# EasyEDA schematic audio chip v2.json
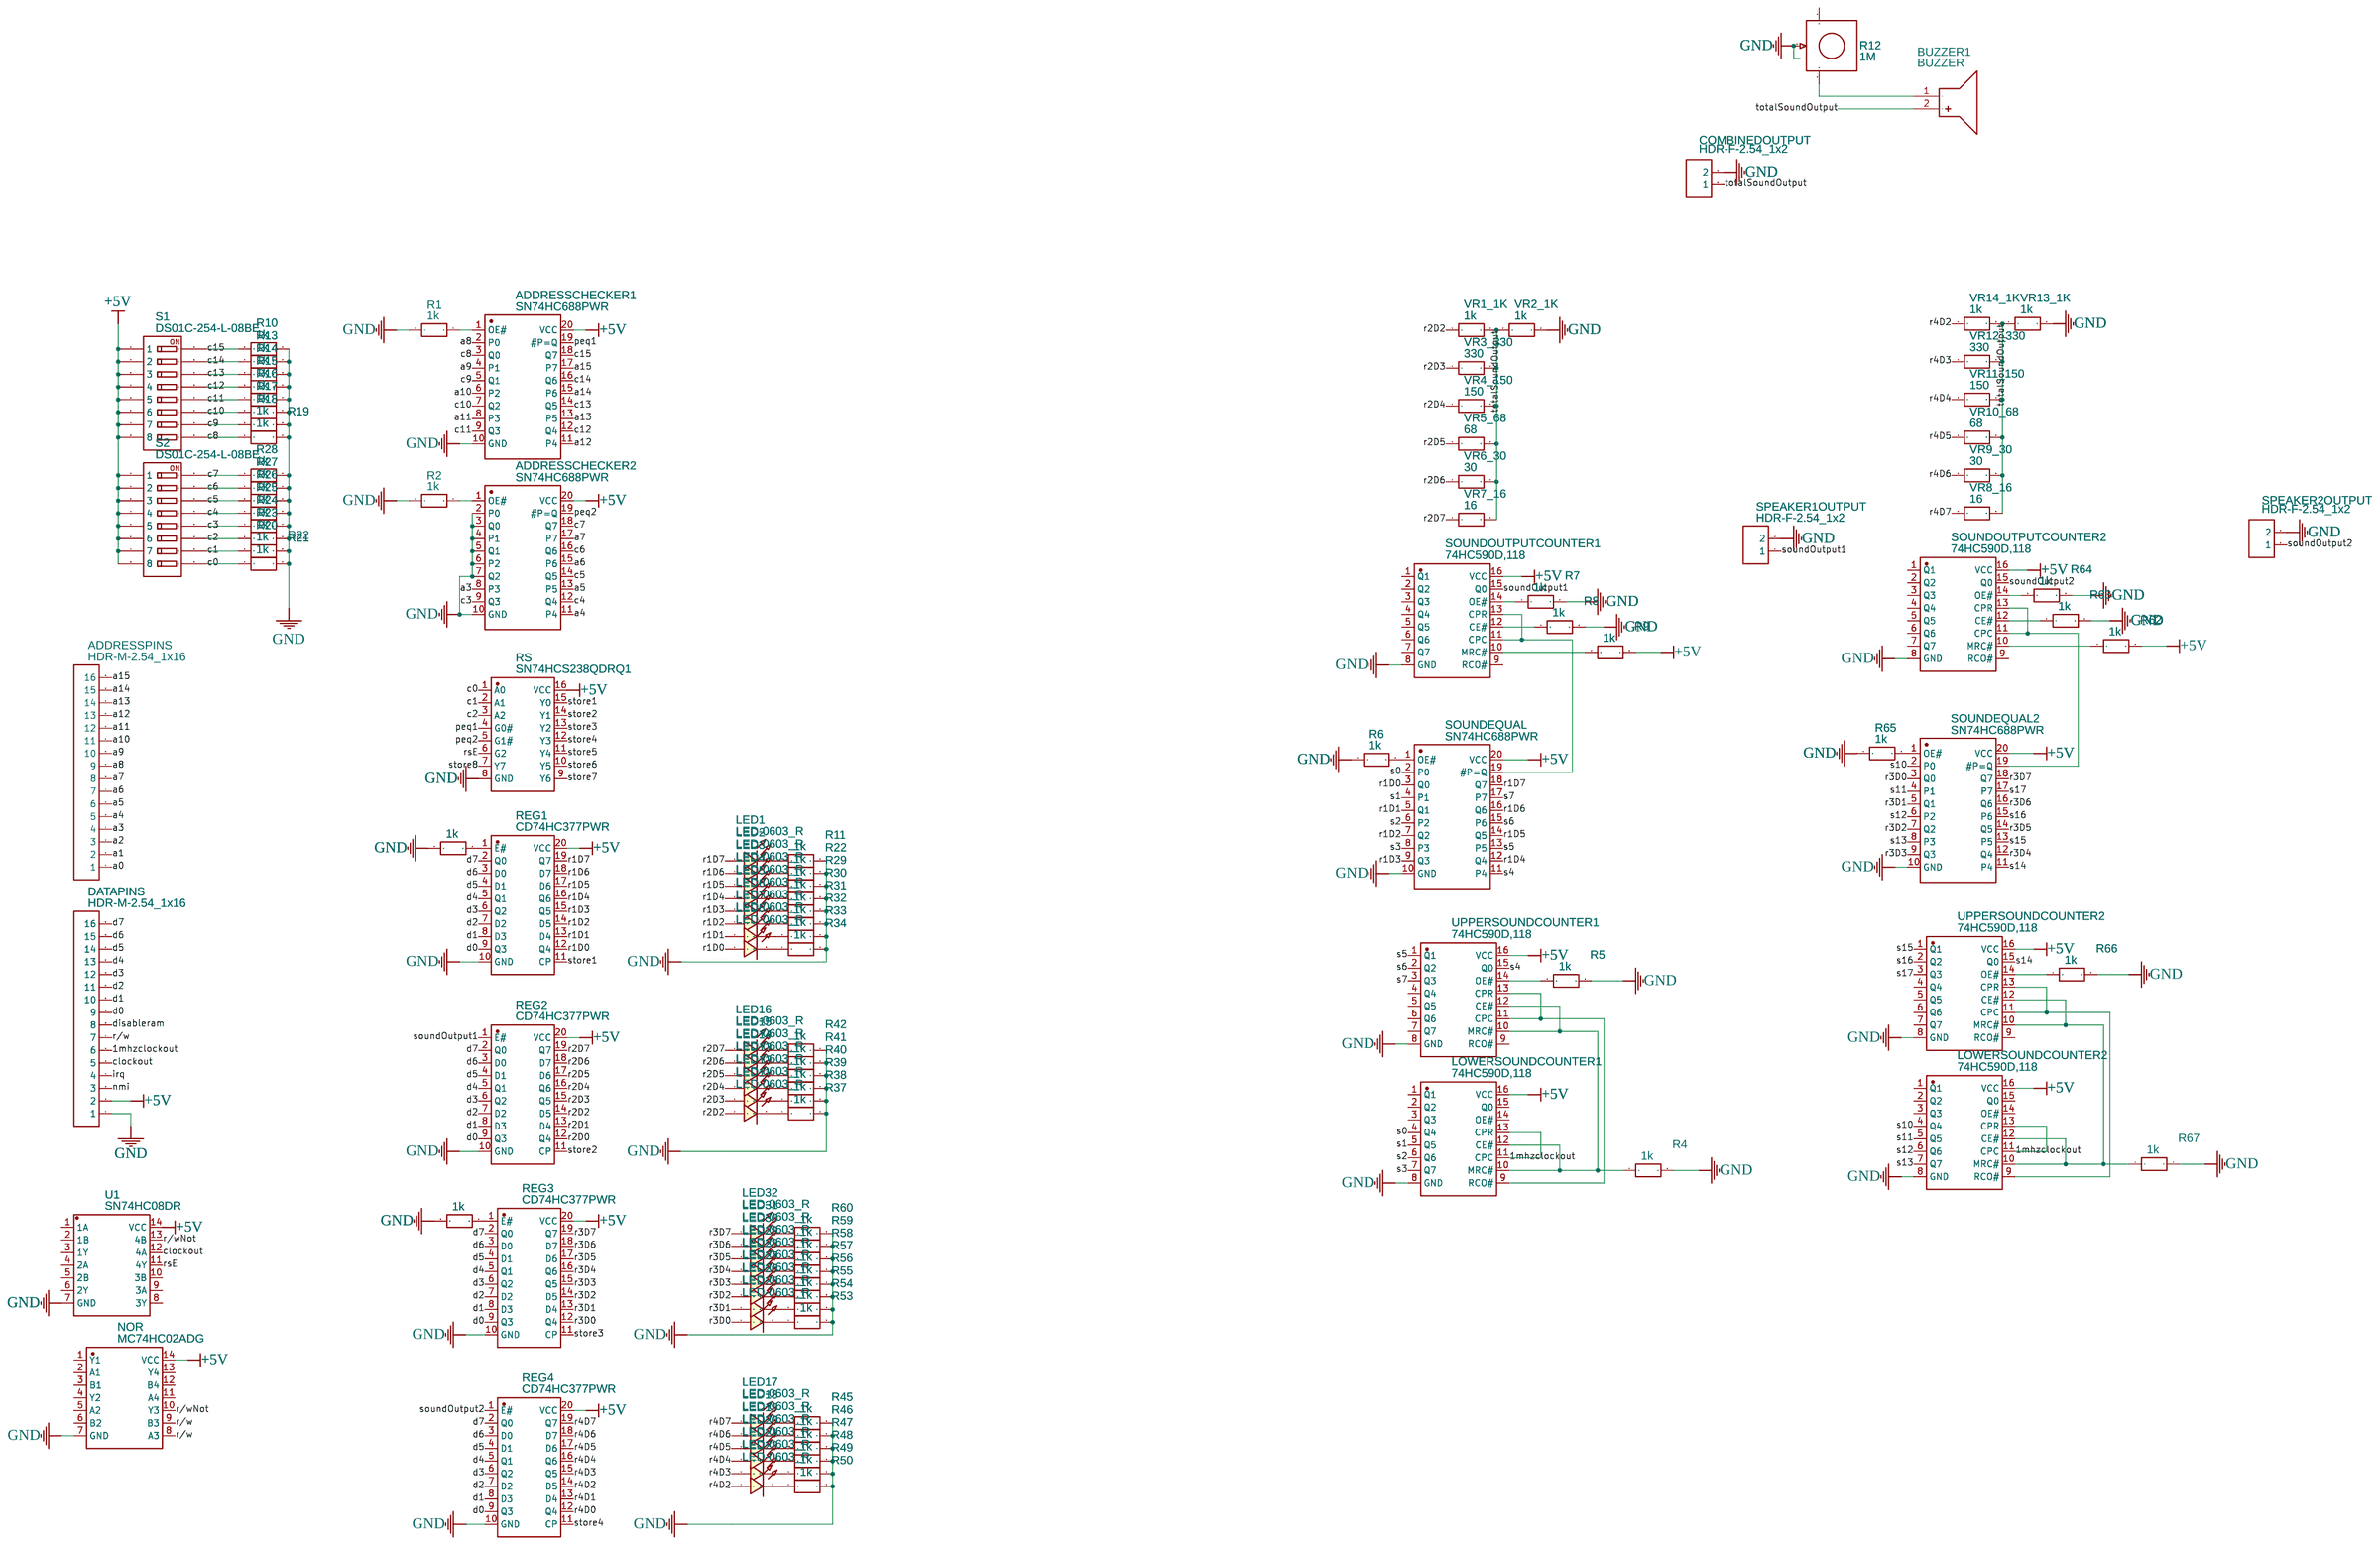
[diagram p0: schematic sheet]

## Parts
ADDRESSCHECKER1  SN74HC688PWR  [TSSOP-20_L6.5-W4.4-P0.65-LS6.4-BL]
ADDRESSCHECKER2  SN74HC688PWR  [TSSOP-20_L6.5-W4.4-P0.65-LS6.4-BL]
ADDRESSPINS  HDR-M-2.54_1x16  [HDR-M-2.54_1X16]
BUZZER1  BUZZER  [BUZ-TH_BD12.0-P6.00-D0.9-RD]
COMBINEDOUTPUT  HDR-F-2.54_1x2  [HDR-F-2.54_1X2]
DATAPINS  HDR-M-2.54_1x16  [HDR-M-2.54_1X16]
LED1  LED-0603_R  [LED0603_RED]
LED2  LED-0603_R  [LED0603_RED]
LED3  LED-0603_R  [LED0603_RED]
LED4  LED-0603_R  [LED0603_RED]
LED5  LED-0603_R  [LED0603_RED]
LED6  LED-0603_R  [LED0603_RED]
LED7  LED-0603_R  [LED0603_RED]
LED8  LED-0603_R  [LED0603_RED]
LED11  LED-0603_R  [LED0603_RED]
LED12  LED-0603_R  [LED0603_RED]
LED13  LED-0603_R  [LED0603_RED]
LED14  LED-0603_R  [LED0603_RED]
LED15  LED-0603_R  [LED0603_RED]
LED16  LED-0603_R  [LED0603_RED]
LED17  LED-0603_R  [LED0603_RED]
LED18  LED-0603_R  [LED0603_RED]
LED19  LED-0603_R  [LED0603_RED]
LED20  LED-0603_R  [LED0603_RED]
LED21  LED-0603_R  [LED0603_RED]
LED22  LED-0603_R  [LED0603_RED]
LED25  LED-0603_R  [LED0603_RED]
LED26  LED-0603_R  [LED0603_RED]
LED27  LED-0603_R  [LED0603_RED]
LED28  LED-0603_R  [LED0603_RED]
LED29  LED-0603_R  [LED0603_RED]
LED30  LED-0603_R  [LED0603_RED]
LED31  LED-0603_R  [LED0603_RED]
LED32  LED-0603_R  [LED0603_RED]
LOWERSOUNDCOUNTER1  74HC590D,118  [SO-16_L9.9-W3.9-P1.27-LS6.0-BL]
LOWERSOUNDCOUNTER2  74HC590D,118  [SO-16_L9.9-W3.9-P1.27-LS6.0-BL]
NOR  MC74HC02ADG  [SOIC-14_L8.7-W3.9-P1.27-LS6.0-BL]
R1  1k  [R1206]
R2  1k  [R1206]
R3  1k  [R1206]
R4  1k  [R1206]
R5  1k  [R1206]
R6  1k  [R1206]
R7  1k  [R1206]
R8  1k  [R1206]
R9  1k  [R1206]
R10  1k  [R1206]
R11  1k  [R1206]
R12  1M  [3386T]
R13  1k  [R1206]
R14  1k  [R1206]
R15  1k  [R1206]
R16  1k  [R1206]
R17  1k  [R1206]
R18  1k  [R1206]
R19  1k  [R1206]
R20  1k  [R1206]
R21  1k  [R1206]
R22  1k  [R1206]
R23  1k  [R1206]
R24  1k  [R1206]
R25  1k  [R1206]
R26  1k  [R1206]
R27  1k  [R1206]
R28  1k  [R1206]
R29  1k  [R1206]
R30  1k  [R1206]
R31  1k  [R1206]
R32  1k  [R1206]
R33  1k  [R1206]
R34  1k  [R1206]
R37  1k  [R1206]
R38  1k  [R1206]
R39  1k  [R1206]
R40  1k  [R1206]
R41  1k  [R1206]
R42  1k  [R1206]
R45  1k  [R1206]
R46  1k  [R1206]
R47  1k  [R1206]
R48  1k  [R1206]
R49  1k  [R1206]
R50  1k  [R1206]
R53  1k  [R1206]
R54  1k  [R1206]
R55  1k  [R1206]
R56  1k  [R1206]
R57  1k  [R1206]
R58  1k  [R1206]
R59  1k  [R1206]
R60  1k  [R1206]
R61  1k  [R1206]
R62  1k  [R1206]
R63  1k  [R1206]
R64  1k  [R1206]
R65  1k  [R1206]
R66  1k  [R1206]
R67  1k  [R1206]
REG1  CD74HC377PWR  [TSSOP-20_L6.5-W4.4-P0.65-LS6.4-BL]
REG2  CD74HC377PWR  [TSSOP-20_L6.5-W4.4-P0.65-LS6.4-BL]
REG3  CD74HC377PWR  [TSSOP-20_L6.5-W4.4-P0.65-LS6.4-BL]
REG4  CD74HC377PWR  [TSSOP-20_L6.5-W4.4-P0.65-LS6.4-BL]
RS  SN74HCS238QDRQ1  [SOIC-16_L9.9-W3.9-P1.27-LS6.0-BL]
S1  DS01C-254-L-08BE  [DS01C-254-L-08BE]
S2  DS01C-254-L-08BE  [DS01C-254-L-08BE]
SOUNDEQUAL  SN74HC688PWR  [TSSOP-20_L6.5-W4.4-P0.65-LS6.4-BL]
SOUNDEQUAL2  SN74HC688PWR  [TSSOP-20_L6.5-W4.4-P0.65-LS6.4-BL]
SOUNDOUTPUTCOUNTER1  74HC590D,118  [SO-16_L9.9-W3.9-P1.27-LS6.0-BL]
SOUNDOUTPUTCOUNTER2  74HC590D,118  [SO-16_L9.9-W3.9-P1.27-LS6.0-BL]
SPEAKER1OUTPUT  HDR-F-2.54_1x2  [HDR-F-2.54_1X2]
SPEAKER2OUTPUT  HDR-F-2.54_1x2  [HDR-F-2.54_1X2]
U1  SN74HC08DR  [SOIC-14_L8.7-W3.9-P1.27-LS6.0-BL]
UPPERSOUNDCOUNTER1  74HC590D,118  [SO-16_L9.9-W3.9-P1.27-LS6.0-BL]
UPPERSOUNDCOUNTER2  74HC590D,118  [SO-16_L9.9-W3.9-P1.27-LS6.0-BL]
VR1_1K  1k  [R1206]
VR2_1K  1k  [R1206]
VR3_330  330  [R1206]
VR4_150  150  [R1206]
VR5_68  68  [R1206]
VR6_30  30  [R1206]
VR7_16  16  [R1206]
VR8_16  16  [R1206]
VR9_30  30  [R1206]
VR10_68  68  [R1206]
VR11_150  150  [R1206]
VR12_330  330  [R1206]
VR13_1K  1k  [R1206]
VR14_1K  1k  [R1206]

## Library data of the parts
ADDRESSCHECKER1 ADDRESSCHECKER2 SOUNDEQUAL SOUNDEQUAL2 = SN74HC688PWR: Contributor: LCSC; Supplier: LCSC; Manufacturer: TI(德州仪器); Supplier Part: C132045; JLCPCB Part Class: Extended Part; link: https://lcsc.com/eda_search?q=C132045&%26type=1&ref=editor
ADDRESSPINS DATAPINS = HDR-M-2.54_1x16: Supplier: LCSC; Contributor: LCEDA_Lib
BUZZER1 = BUZZER: Contributor: lcsc; Supplier: LCSC; Supplier Part: C9900014030; Manufacturer: null; Manufacturer Part: buzzer; JLCPCB Part Class: Extended Part; link: https://lcsc.com/eda_search?q=C9900014030&%26type=1&ref=editor
COMBINEDOUTPUT SPEAKER1OUTPUT SPEAKER2OUTPUT = HDR-F-2.54_1x2: Supplier Part: C49661; Supplier: LCSC; Contributor: LCEDA_Lib
LED1-LED8 LED11-LED22 LED25-LED32 = LED-0603_R: Manufacturer: EVERLIGHT(台湾亿光); Manufacturer Part: 19-217/R6C-AL1M2VY/3T; Supplier Part: C72044; Supplier: LCSC; Contributor: LCEDA_01
LOWERSOUNDCOUNTER1 LOWERSOUNDCOUNTER2 SOUNDOUTPUTCOUNTER1 SOUNDOUTPUTCOUNTER2 UPPERSOUNDCOUNTER1 UPPERSOUNDCOUNTER2 = 74HC590D,118: Contributor: LCSC; Supplier: LCSC; Supplier Part: C547118; Manufacturer: Nexperia(安世); JLCPCB Part Class: Extended Part; link: https://lcsc.com/eda_search?q=C547118&%26type=1&ref=editor
NOR = MC74HC02ADG: Contributor: LCSC; Supplier: LCSC; Supplier Part: C233598; Manufacturer: onsemi(安森美); JLCPCB Part Class: Extended Part; link: https://lcsc.com/eda_search?q=C233598&%26type=1&ref=editor
R1-R11 R13-R34 R37-R42 R45-R50 R53-R67 VR1_1K VR2_1K VR3_330 VR4_150 VR5_68 VR6_30 VR7_16 VR8_16 VR9_30 VR10_68 VR11_150 VR12_330 VR13_1K VR14_1K = R_1206_EU: Contributor: LCEDA_Lib
R12 = 3/8 Inch Square Cermet Potentiometer 1MEG Ohms 1/2 Watt 1 Turn Thru Hole: Manufacturer: Jameco ValuePro; Manufacturer Part: 3386T-1-LS1MEG(105); Supplier Part: 2161422; link: https://www.jameco.com/webapp/wcs/stores/servlet/ProductDisplay?storeId=10001&langId=-1&catalogId=10001&productId=2161422; Contributor: dissy614
REG1-REG4 = CD74HC377PWR: Contributor: LCSC; Supplier: LCSC; Supplier Part: C2677832; Manufacturer: TI(德州仪器); JLCPCB Part Class: Extended Part; link: https://lcsc.com/eda_search?q=C2677832&%26type=1&ref=editor
RS = SN74HCS238QDRQ1: Contributor: lcsc; Supplier: LCSC; Supplier Part: C2878562; Manufacturer: TI(德州仪器); link: https://lcsc.com/eda_search?q=C2878562&%26type=1&ref=editor
S1 S2 = DS01C-254-L-08BE: Manufacturer: CUI Devices; Manufacturer Part: DS01C-254-L-07BE; Supplier: Mouser; Supplier Part: 490-DS01C-254-L-07BE; link: https://www.mouser.com/datasheet/2/670/ds01-254-1777712.pdf; Contributor: CK Sim
U1 = SN74HC08DR: Contributor: LCSC; Supplier: LCSC; Supplier Part: C337768; Manufacturer: TI(德州仪器); JLCPCB Part Class: Extended Part; link: https://lcsc.com/eda_search?q=C337768&%26type=1&ref=editor

## Nets
+5V: ADDRESSCHECKER1.20(VCC) ADDRESSCHECKER2.20(VCC) DATAPINS.2 LOWERSOUNDCOUNTER1.16(VCC) LOWERSOUNDCOUNTER2.16(VCC) NOR.14(VCC) R9.2 R62.2 REG1.20(VCC) REG2.20(VCC) REG3.20(VCC) REG4.20(VCC) RS.16(VCC) S1.1 S1.2 S1.3 S1.4 S1.5 S1.6 S1.7 S1.8 S2.1 S2.2 S2.3 S2.4 S2.5 S2.6 S2.7 S2.8 SOUNDEQUAL.20(VCC) SOUNDEQUAL2.20(VCC) SOUNDOUTPUTCOUNTER1.16(VCC) SOUNDOUTPUTCOUNTER2.16(VCC) U1.14(VCC) UPPERSOUNDCOUNTER1.16(VCC) UPPERSOUNDCOUNTER2.16(VCC)
GND: ADDRESSCHECKER1.10(GND) ADDRESSCHECKER2.2(P0) ADDRESSCHECKER2.3(Q0) ADDRESSCHECKER2.4(P1) ADDRESSCHECKER2.5(Q1) ADDRESSCHECKER2.6(P2) ADDRESSCHECKER2.7(Q2) ADDRESSCHECKER2.10(GND) COMBINEDOUTPUT.2 DATAPINS.1 LOWERSOUNDCOUNTER1.8(GND) LOWERSOUNDCOUNTER2.8(GND) NOR.7(GND) R1.1 R2.1 R3.1 R4.2 R5.2 R6.1 R7.2 R8.2 R10.2 R11.2 R12.2 R13.2 R14.2 R15.2 R16.2 R17.2 R18.2 R19.2 R20.2 R21.2 R22.2 R23.2 R24.2 R25.2 R26.2 R27.2 R28.2 R29.2 R30.2 R31.2 R32.2 R33.2 R34.2 R37.2 R38.2 R39.2 R40.2 R41.2 R42.2 R45.2 R46.2 R47.2 R48.2 R49.2 R50.2 R53.2 R54.2 R55.2 R56.2 R57.2 R58.2 R59.2 R60.2 R61.1 R63.2 R64.2 R65.1 R66.2 R67.2 REG1.10(GND) REG2.10(GND) REG3.10(GND) REG4.10(GND) RS.8(GND) SOUNDEQUAL.10(GND) SOUNDEQUAL2.10(GND) SOUNDOUTPUTCOUNTER1.8(GND) SOUNDOUTPUTCOUNTER2.8(GND) SPEAKER1OUTPUT.2 SPEAKER2OUTPUT.2 U1.7(GND) UPPERSOUNDCOUNTER1.8(GND) UPPERSOUNDCOUNTER2.8(GND) VR2_1K.2 VR13_1K.2
1mhzclockout: DATAPINS.6 LOWERSOUNDCOUNTER1.11(CPC) LOWERSOUNDCOUNTER1.13(CPR) LOWERSOUNDCOUNTER2.11(CPC) LOWERSOUNDCOUNTER2.13(CPR)
a0: ADDRESSPINS.1
a1: ADDRESSPINS.2
a2: ADDRESSPINS.3
a3: ADDRESSCHECKER2.8(P3) ADDRESSPINS.4
a4: ADDRESSCHECKER2.11(P4) ADDRESSPINS.5
a5: ADDRESSCHECKER2.13(P5) ADDRESSPINS.6
a6: ADDRESSCHECKER2.15(P6) ADDRESSPINS.7
a7: ADDRESSCHECKER2.17(P7) ADDRESSPINS.8
a8: ADDRESSCHECKER1.2(P0) ADDRESSPINS.9
a9: ADDRESSCHECKER1.4(P1) ADDRESSPINS.10
a10: ADDRESSCHECKER1.6(P2) ADDRESSPINS.11
a11: ADDRESSCHECKER1.8(P3) ADDRESSPINS.12
a12: ADDRESSCHECKER1.11(P4) ADDRESSPINS.13
a13: ADDRESSCHECKER1.13(P5) ADDRESSPINS.14
a14: ADDRESSCHECKER1.15(P6) ADDRESSPINS.15
a15: ADDRESSCHECKER1.17(P7) ADDRESSPINS.16
c0: R21.1 RS.1(A0) S2.9
c1: R20.1 RS.2(A1) S2.10
c2: R23.1 RS.3(A2) S2.11
c3: ADDRESSCHECKER2.9(Q3) R24.1 S2.12
c4: ADDRESSCHECKER2.12(Q4) R25.1 S2.13
c5: ADDRESSCHECKER2.14(Q5) R26.1 S2.14
c6: ADDRESSCHECKER2.16(Q6) R27.1 S2.15
c7: ADDRESSCHECKER2.18(Q7) R28.1 S2.16
c8: ADDRESSCHECKER1.3(Q0) R19.1 S1.9
c9: ADDRESSCHECKER1.5(Q1) R18.1 S1.10
c10: ADDRESSCHECKER1.7(Q2) R17.1 S1.11
c11: ADDRESSCHECKER1.9(Q3) R16.1 S1.12
c12: ADDRESSCHECKER1.12(Q4) R15.1 S1.13
c13: ADDRESSCHECKER1.14(Q5) R14.1 S1.14
c14: ADDRESSCHECKER1.16(Q6) R13.1 S1.15
c15: ADDRESSCHECKER1.18(Q7) R10.1 S1.16
clockout: DATAPINS.5 U1.12(4A)
d0: DATAPINS.9 REG1.9(Q3) REG2.9(Q3) REG3.9(Q3) REG4.9(Q3)
d1: DATAPINS.10 REG1.8(D3) REG2.8(D3) REG3.8(D3) REG4.8(D3)
d2: DATAPINS.11 REG1.7(D2) REG2.7(D2) REG3.7(D2) REG4.7(D2)
d3: DATAPINS.12 REG1.6(Q2) REG2.6(Q2) REG3.6(Q2) REG4.6(Q2)
d4: DATAPINS.13 REG1.5(Q1) REG2.5(Q1) REG3.5(Q1) REG4.5(Q1)
d5: DATAPINS.14 REG1.4(D1) REG2.4(D1) REG3.4(D1) REG4.4(D1)
d6: DATAPINS.15 REG1.3(D0) REG2.3(D0) REG3.3(D0) REG4.3(D0)
d7: DATAPINS.16 REG1.2(Q0) REG2.2(Q0) REG3.2(Q0) REG4.2(Q0)
disableram: DATAPINS.8
irq: DATAPINS.4
nmi: DATAPINS.3
peq1: ADDRESSCHECKER1.19(#P=Q) RS.4(G0#)
peq2: ADDRESSCHECKER2.19(#P=Q) RS.5(G1#)
r1D0: LED8.1 REG1.12(Q4) SOUNDEQUAL.3(Q0)
r1D1: LED7.1 REG1.13(D4) SOUNDEQUAL.5(Q1)
r1D2: LED6.1 REG1.14(D5) SOUNDEQUAL.7(Q2)
r1D3: LED5.1 REG1.15(Q5) SOUNDEQUAL.9(Q3)
r1D4: LED4.1 REG1.16(Q6) SOUNDEQUAL.12(Q4)
r1D5: LED3.1 REG1.17(D6) SOUNDEQUAL.14(Q5)
r1D6: LED2.1 REG1.18(D7) SOUNDEQUAL.16(Q6)
r1D7: LED1.1 REG1.19(Q7) SOUNDEQUAL.18(Q7)
r2D0: REG2.12(Q4)
r2D1: REG2.13(D4)
r2D2: LED11.1 REG2.14(D5) VR1_1K.1
r2D3: LED12.1 REG2.15(Q5) VR3_330.1
r2D4: LED13.1 REG2.16(Q6) VR4_150.1
r2D5: LED14.1 REG2.17(D6) VR5_68.1
r2D6: LED15.1 REG2.18(D7) VR6_30.1
r2D7: LED16.1 REG2.19(Q7) VR7_16.1
r3D0: LED25.1 REG3.12(Q4) SOUNDEQUAL2.3(Q0)
r3D1: LED26.1 REG3.13(D4) SOUNDEQUAL2.5(Q1)
r3D2: LED27.1 REG3.14(D5) SOUNDEQUAL2.7(Q2)
r3D3: LED28.1 REG3.15(Q5) SOUNDEQUAL2.9(Q3)
r3D4: LED29.1 REG3.16(Q6) SOUNDEQUAL2.12(Q4)
r3D5: LED30.1 REG3.17(D6) SOUNDEQUAL2.14(Q5)
r3D6: LED31.1 REG3.18(D7) SOUNDEQUAL2.16(Q6)
r3D7: LED32.1 REG3.19(Q7) SOUNDEQUAL2.18(Q7)
r4D0: REG4.12(Q4)
r4D1: REG4.13(D4)
r4D2: LED22.1 REG4.14(D5) VR14_1K.1
r4D3: LED21.1 REG4.15(Q5) VR12_330.1
r4D4: LED20.1 REG4.16(Q6) VR11_150.1
r4D5: LED19.1 REG4.17(D6) VR10_68.1
r4D6: LED18.1 REG4.18(D7) VR9_30.1
r4D7: LED17.1 REG4.19(Q7) VR8_16.1
r/w: DATAPINS.7 NOR.8(A3) NOR.9(B3)
r/wNot: NOR.10(Y3) U1.13(4B)
rsE: RS.6(G2) U1.11(4Y)
s0: LOWERSOUNDCOUNTER1.4(Q4) SOUNDEQUAL.2(P0)
s1: LOWERSOUNDCOUNTER1.5(Q5) SOUNDEQUAL.4(P1)
s2: LOWERSOUNDCOUNTER1.6(Q6) SOUNDEQUAL.6(P2)
s3: LOWERSOUNDCOUNTER1.7(Q7) SOUNDEQUAL.8(P3)
s4: SOUNDEQUAL.11(P4) UPPERSOUNDCOUNTER1.15(Q0)
s5: SOUNDEQUAL.13(P5) UPPERSOUNDCOUNTER1.1(Q1)
s6: SOUNDEQUAL.15(P6) UPPERSOUNDCOUNTER1.2(Q2)
s7: SOUNDEQUAL.17(P7) UPPERSOUNDCOUNTER1.3(Q3)
s10: LOWERSOUNDCOUNTER2.4(Q4) SOUNDEQUAL2.2(P0)
s11: LOWERSOUNDCOUNTER2.5(Q5) SOUNDEQUAL2.4(P1)
s12: LOWERSOUNDCOUNTER2.6(Q6) SOUNDEQUAL2.6(P2)
s13: LOWERSOUNDCOUNTER2.7(Q7) SOUNDEQUAL2.8(P3)
s14: SOUNDEQUAL2.11(P4) UPPERSOUNDCOUNTER2.15(Q0)
s15: SOUNDEQUAL2.13(P5) UPPERSOUNDCOUNTER2.1(Q1)
s16: SOUNDEQUAL2.15(P6) UPPERSOUNDCOUNTER2.2(Q2)
s17: SOUNDEQUAL2.17(P7) UPPERSOUNDCOUNTER2.3(Q3)
soundOutput1: REG2.1(E#) SOUNDOUTPUTCOUNTER1.15(Q0) SPEAKER1OUTPUT.1
soundOutput2: REG4.1(E#) SOUNDOUTPUTCOUNTER2.15(Q0) SPEAKER2OUTPUT.1
store1: REG1.11(CP) RS.15(Y0)
store2: REG2.11(CP) RS.14(Y1)
store3: REG3.11(CP) RS.13(Y2)
store4: REG4.11(CP) RS.12(Y3)
store5: RS.11(Y4)
store6: RS.10(Y5)
store7: RS.9(Y6)
store8: RS.7(Y7)
totalSoundOutput: BUZZER1.2(+) COMBINEDOUTPUT.1 VR1_1K.2 VR2_1K.1 VR3_330.2 VR4_150.2 VR5_68.2 VR6_30.2 VR7_16.2 VR8_16.2 VR9_30.2 VR10_68.2 VR11_150.2 VR12_330.2 VR13_1K.1 VR14_1K.2
Net-(ADDRESSCHECKER1-1): ADDRESSCHECKER1.1(OE#) R1.2
Net-(ADDRESSCHECKER2-1): ADDRESSCHECKER2.1(OE#) R2.2
Net-(BUZZER1-1): BUZZER1.1(-) R12.3
Net-(LED1-2): LED1.2 R11.1
Net-(LED2-2): LED2.2 R22.1
Net-(LED3-2): LED3.2 R29.1
Net-(LED4-2): LED4.2 R30.1
Net-(LED5-2): LED5.2 R31.1
Net-(LED6-2): LED6.2 R32.1
Net-(LED7-2): LED7.2 R33.1
Net-(LED8-2): LED8.2 R34.1
Net-(LED11-2): LED11.2 R37.1
Net-(LED12-2): LED12.2 R38.1
Net-(LED13-2): LED13.2 R39.1
Net-(LED14-2): LED14.2 R40.1
Net-(LED15-2): LED15.2 R41.1
Net-(LED16-2): LED16.2 R42.1
Net-(LED17-2): LED17.2 R45.1
Net-(LED18-2): LED18.2 R46.1
Net-(LED19-2): LED19.2 R47.1
Net-(LED20-2): LED20.2 R48.1
Net-(LED21-2): LED21.2 R49.1
Net-(LED22-2): LED22.2 R50.1
Net-(LED25-2): LED25.2 R53.1
Net-(LED26-2): LED26.2 R54.1
Net-(LED27-2): LED27.2 R55.1
Net-(LED28-2): LED28.2 R56.1
Net-(LED29-2): LED29.2 R57.1
Net-(LED30-2): LED30.2 R58.1
Net-(LED31-2): LED31.2 R59.1
Net-(LED32-2): LED32.2 R60.1
Net-(LOWERSOUNDCOUNTER1-9): LOWERSOUNDCOUNTER1.9(RCO#) UPPERSOUNDCOUNTER1.11(CPC) UPPERSOUNDCOUNTER1.13(CPR)
Net-(LOWERSOUNDCOUNTER1-10): LOWERSOUNDCOUNTER1.10(MRC#) LOWERSOUNDCOUNTER1.12(CE#) R4.1 UPPERSOUNDCOUNTER1.10(MRC#) UPPERSOUNDCOUNTER1.12(CE#)
Net-(LOWERSOUNDCOUNTER2-9): LOWERSOUNDCOUNTER2.9(RCO#) UPPERSOUNDCOUNTER2.11(CPC) UPPERSOUNDCOUNTER2.13(CPR)
Net-(LOWERSOUNDCOUNTER2-10): LOWERSOUNDCOUNTER2.10(MRC#) LOWERSOUNDCOUNTER2.12(CE#) R67.1 UPPERSOUNDCOUNTER2.10(MRC#) UPPERSOUNDCOUNTER2.12(CE#)
Net-(R3-2): R3.2 REG1.1(E#)
Net-(R5-1): R5.1 UPPERSOUNDCOUNTER1.14(OE#)
Net-(R6-2): R6.2 SOUNDEQUAL.1(OE#)
Net-(R7-1): R7.1 SOUNDOUTPUTCOUNTER1.14(OE#)
Net-(R8-1): R8.1 SOUNDOUTPUTCOUNTER1.12(CE#)
Net-(R9-1): R9.1 SOUNDOUTPUTCOUNTER1.10(MRC#)
Net-(R61-2): R61.2 REG3.1(E#)
Net-(R62-1): R62.1 SOUNDOUTPUTCOUNTER2.10(MRC#)
Net-(R63-1): R63.1 SOUNDOUTPUTCOUNTER2.12(CE#)
Net-(R64-1): R64.1 SOUNDOUTPUTCOUNTER2.14(OE#)
Net-(R65-2): R65.2 SOUNDEQUAL2.1(OE#)
Net-(R66-1): R66.1 UPPERSOUNDCOUNTER2.14(OE#)
Net-(SOUNDEQUAL2-19): SOUNDEQUAL2.19(#P=Q) SOUNDOUTPUTCOUNTER2.11(CPC) SOUNDOUTPUTCOUNTER2.13(CPR)
Net-(SOUNDEQUAL-19): SOUNDEQUAL.19(#P=Q) SOUNDOUTPUTCOUNTER1.11(CPC) SOUNDOUTPUTCOUNTER1.13(CPR)

Not connected (* = marked no-connect by the designer): LOWERSOUNDCOUNTER1 1(Q1) 2(Q2) 3(Q3) 14(OE#) 15(Q0); LOWERSOUNDCOUNTER2 1(Q1) 2(Q2) 3(Q3) 14(OE#) 15(Q0); NOR 1(Y1) 2(A1) 3(B1) 4(Y2) 5(A2) 6(B2) 11(A4) 12(B4) 13(Y4); R12 1; SOUNDOUTPUTCOUNTER1 1(Q1) 2(Q2) 3(Q3) 4(Q4) 5(Q5) 6(Q6) 7(Q7) 9(RCO#); SOUNDOUTPUTCOUNTER2 1(Q1) 2(Q2) 3(Q3) 4(Q4) 5(Q5) 6(Q6) 7(Q7) 9(RCO#); U1 1(1A) 2(1B) 3(1Y) 4(2A) 5(2B) 6(2Y) 8(3Y) 9(3A) 10(3B); UPPERSOUNDCOUNTER1 4(Q4) 5(Q5) 6(Q6) 7(Q7) 9(RCO#); UPPERSOUNDCOUNTER2 4(Q4) 5(Q5) 6(Q6) 7(Q7) 9(RCO#)

## Notes on the sheet
- R22
